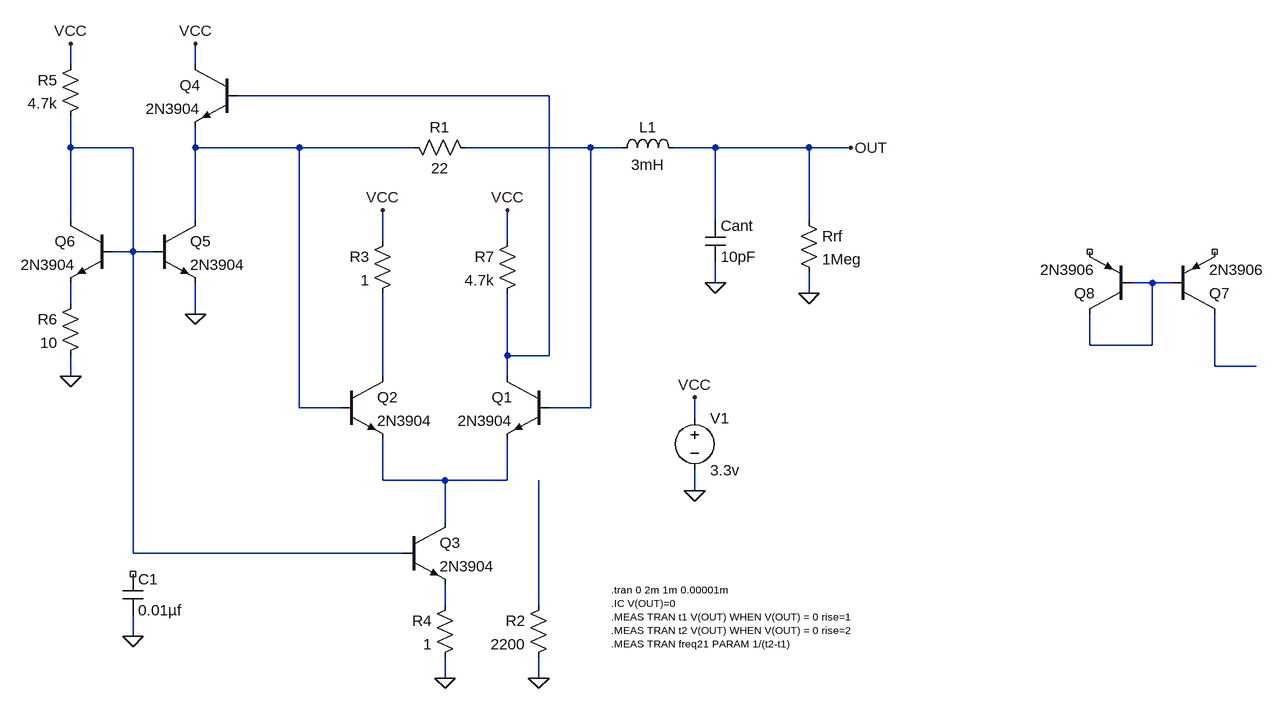
[diagram p0: schematic diff_osc_dewster_2020-11-15_experiments_v2.asc]
diff_osc_dewster_2020-11-15_experiments_v2.asc, the LTspice schematic file:
Version 4
SHEET 1 2908 996
WIRE -240 -160 -240 -192
WIRE -48 -160 -48 -192
WIRE 496 -112 16 -112
WIRE -240 -32 -240 -80
WIRE -144 -32 -240 -32
WIRE -48 -32 -48 -64
WIRE 112 -32 -48 -32
WIRE 288 -32 112 -32
WIRE 560 -32 368 -32
WIRE 608 -32 560 -32
WIRE 752 -32 688 -32
WIRE 896 -32 752 -32
WIRE 960 -32 896 -32
WIRE -240 80 -240 -32
WIRE -48 80 -48 -32
WIRE 752 80 752 -32
WIRE 896 80 896 -32
WIRE 240 112 240 64
WIRE 432 112 432 64
WIRE -144 128 -144 -32
WIRE -144 128 -176 128
WIRE -112 128 -144 128
WIRE 752 176 752 144
WIRE 1424 176 1392 176
WIRE 1456 176 1424 176
WIRE 896 192 896 160
WIRE -240 208 -240 176
WIRE -48 224 -48 176
WIRE 1328 272 1328 224
WIRE 1424 272 1424 176
WIRE 1424 272 1328 272
WIRE 432 288 432 192
WIRE 496 288 496 -112
WIRE 496 288 432 288
WIRE 1520 304 1520 224
WIRE 1584 304 1520 304
WIRE -240 320 -240 288
WIRE 240 320 240 192
WIRE 432 320 432 288
WIRE 112 368 112 -32
WIRE 176 368 112 368
WIRE 560 368 560 -32
WIRE 560 368 496 368
WIRE 720 384 720 352
WIRE 240 480 240 416
WIRE 336 480 240 480
WIRE 432 480 432 416
WIRE 432 480 336 480
WIRE 720 496 720 464
WIRE 336 544 336 480
WIRE -144 592 -144 128
WIRE 272 592 -144 592
WIRE 336 672 336 640
WIRE 480 672 480 480
WIRE -144 720 -144 688
WIRE 336 784 336 752
WIRE 480 784 480 752
FLAG 720 496 0
FLAG 720 352 VCC
FLAG 960 -32 OUT
FLAG 752 176 0
FLAG 896 192 0
FLAG -48 224 0
FLAG -240 -192 VCC
FLAG -240 320 0
FLAG 336 784 0
FLAG -144 720 0
FLAG -48 -192 VCC
FLAG 240 64 VCC
FLAG 432 64 VCC
FLAG 480 784 0
SYMBOL res 384 -16 M270
WINDOW 0 32 56 VTop 2
WINDOW 3 0 56 VBottom 2
SYMATTR InstName R1
SYMATTR Value 22
SYMBOL voltage 720 368 R0
WINDOW 123 0 0 Left 2
WINDOW 39 0 0 Left 2
SYMATTR InstName V1
SYMATTR Value 3.3v
SYMBOL npn 176 320 R0
SYMATTR InstName Q2
SYMATTR Value 2N3904
SYMBOL ind 592 -16 R270
WINDOW 0 32 56 VTop 2
WINDOW 3 5 56 VBottom 2
SYMATTR InstName L1
SYMATTR Value 3mH
SYMATTR SpiceLine Rser=120 Cpar=1.2pF
SYMBOL cap 736 80 R0
SYMATTR InstName Cant
SYMATTR Value 10pF
SYMBOL npn 496 320 M0
SYMATTR InstName Q1
SYMATTR Value 2N3904
SYMBOL npn 16 -160 M0
SYMATTR InstName Q4
SYMATTR Value 2N3904
SYMBOL res 880 64 R0
SYMATTR InstName Rrf
SYMATTR Value 1Meg
SYMBOL res -224 -176 M0
SYMATTR InstName R5
SYMATTR Value 4.7k
SYMBOL npn -112 80 R0
SYMATTR InstName Q5
SYMATTR Value 2N3904
SYMBOL npn -176 80 M0
SYMATTR InstName Q6
SYMATTR Value 2N3904
SYMBOL res -224 192 M0
SYMATTR InstName R6
SYMATTR Value 10
SYMBOL npn 272 544 R0
SYMATTR InstName Q3
SYMATTR Value 2N3904
SYMBOL res 352 656 M0
SYMATTR InstName R4
SYMATTR Value 1
SYMBOL cap -160 624 R0
SYMATTR InstName C1
SYMATTR Value 0.01µf
SYMBOL pnp 1456 224 M180
SYMATTR InstName Q7
SYMATTR Value 2N3906
SYMBOL pnp 1392 224 R180
SYMATTR InstName Q8
SYMATTR Value 2N3906
SYMBOL res 496 656 M0
SYMATTR InstName R2
SYMATTR Value 2200
SYMBOL res 256 96 M0
SYMATTR InstName R3
SYMATTR Value 1
SYMBOL res 448 96 M0
SYMATTR InstName R7
SYMATTR Value 4.7k
TEXT 592 648 Left 1 !.tran 0 2m 1m 0.00001m\n.IC V(OUT)=0\n.MEAS TRAN t1 V(OUT) WHEN V(OUT) = 0 rise=1\n.MEAS TRAN t2 V(OUT) WHEN V(OUT) = 0 rise=2\n.MEAS TRAN freq21 PARAM 1/(t2-t1)

The netlist it stands for:
* diff_osc_dewster_2020-11-15_experiments_v2.asc
R1 N004 N003 22
V1 VCC 0 3.3v
Q2 N008 N003 N009 0 2N3904
L1 N004 OUT 3mH Rser=120 Cpar=1.2pF
Cant OUT 0 10pF
Q1 N001 N004 N009 0 2N3904
Q4 VCC N001 N003 0 2N3904
Rrf OUT 0 1Meg
R5 VCC N002 4.7k
Q5 N003 N002 0 0 2N3904
Q6 N002 N002 N006 0 2N3904
R6 N006 0 10
Q3 N009 N002 N010 0 2N3904
R4 N010 0 1
C1 NC_01 0 0.01µf
Q7 N007 N005 NC_02 0 2N3906
Q8 N005 N005 NC_03 0 2N3906
R2 N011 0 2200
R3 VCC N008 1
R7 VCC N001 4.7k
.model NPN NPN
.model PNP PNP
.lib standard.bjt
.tran 0 2m 1m 0.00001m
.IC V(OUT)=0
.MEAS TRAN t1 V(OUT) WHEN V(OUT) = 0 rise=1
.MEAS TRAN t2 V(OUT) WHEN V(OUT) = 0 rise=2
.MEAS TRAN freq21 PARAM 1/(t2-t1)
.backanno
.end